# EAGLE schematic version2 (EAGLE 8.0.1)
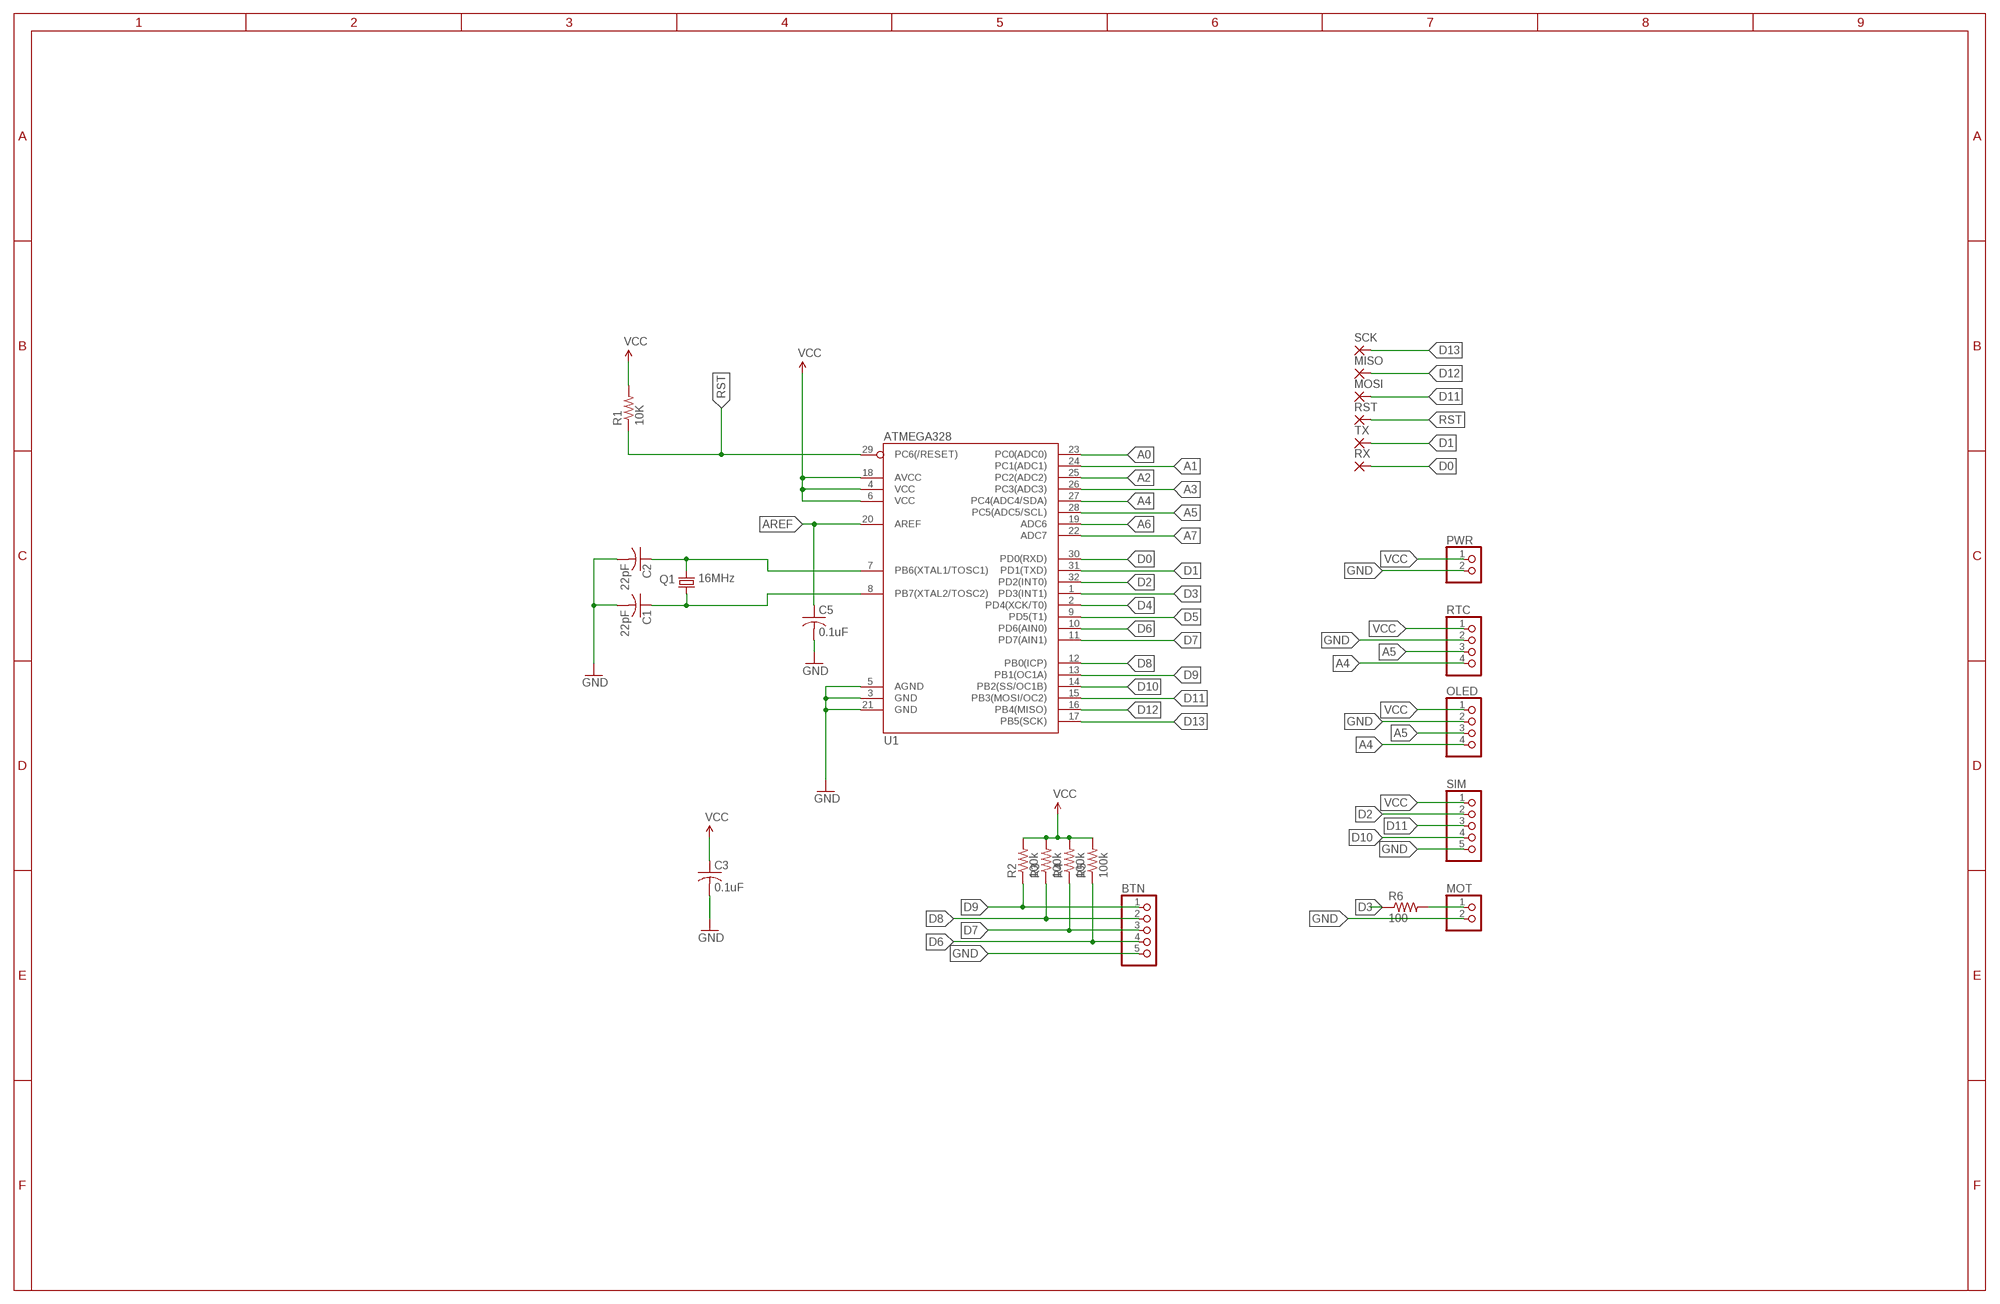
[diagram p0: schematic, sheet 1]
FRAME1 (FRAME_B_L): DESIGNER: PRATIK MAKWANA; DOC: 1; REV: 1.0.0

## Parts
BTN  PINHD-1X5  [1X05]
C1  22pF  C-USC1206  [C1206]
C2  22pF  C-USC1206  [C1206]
C3  0.1uF  C-USC0805  [C0805]
C5  0.1uF  C-USC0805  [C0805]
MISO  SMD2  [SMD1,27-2,54]
MOSI  SMD2  [SMD1,27-2,54]
MOT  PINHD-1X2  [1X02]
OLED  PINHD-1X4  [1X04]
PWR  PINHD-1X2  [1X02]
Q1  16MHz  CRYSTALTC26V  [TC26V]
R1  10K  R-US_R1206  [R1206]
R2  100k  R-US_R1206  [R1206]
R3  100k  R-US_R1206  [R1206]
R4  100k  R-US_R1206  [R1206]
R5  100k  R-US_R1206  [R1206]
R6  100  R-US_R1206  [R1206]
RST  SMD2  [SMD1,27-2,54]
RTC  PINHD-1X4  [1X04]
RX  SMD2  [SMD1,27-2,54]
SCK  SMD2  [SMD1,27-2,54]
SIM  PINHD-1X5  [1X05]
TX  SMD2  [SMD1,27-2,54]
U1  ATMEGA328  [TQFP32-08]

## Nets
A0: U1.23(PC0(ADC0))
A1: U1.24(PC1(ADC1))
A2: U1.25(PC2(ADC2))
A3: U1.26(PC3(ADC3))
A4: OLED.4 RTC.4 U1.27(PC4(ADC4/SDA))
A5: OLED.3 RTC.3 U1.28(PC5(ADC5/SCL))
A6: U1.19(ADC6)
A7: U1.22(ADC7)
AREF: C5.1 U1.20(AREF)
D0: RX.1(P) U1.30(PD0(RXD))
D1: TX.1(P) U1.31(PD1(TXD))
D2: SIM.2 U1.32(PD2(INT0))
D3: R6.1 U1.1(PD3(INT1))
D4: U1.2(PD4(XCK/T0))
D5: U1.9(PD5(T1))
D6: BTN.4 R5.1 U1.10(PD6(AIN0))
D7: BTN.3 R4.1 U1.11(PD7(AIN1))
D8: BTN.2 R3.1 U1.12(PB0(ICP))
D9: BTN.1 R2.1 U1.13(PB1(OC1A))
D10: SIM.4 U1.14(PB2(SS/OC1B))
D11: MOSI.1(P) SIM.3 U1.15(PB3(MOSI/OC2))
D12: MISO.1(P) U1.16(PB4(MISO))
D13: SCK.1(P) U1.17(PB5(SCK))
GND: BTN.5 C1.2 C2.2 C3.2 C5.2 MOT.2 OLED.2 PWR.2 RTC.2 SIM.5 U1.3(GND) U1.5(AGND) U1.21(GND)
N$1: MOT.1 R6.2
N$43: C2.1 Q1.2 U1.7(PB6(XTAL1/TOSC1))
N$44: C1.1 Q1.1 U1.8(PB7(XTAL2/TOSC2))
RST: R1.1 RST.1(P) U1.29(PC6(/RESET))
VCC: C3.1 OLED.1 PWR.1 R1.2 R2.2 R3.2 R4.2 R5.2 RTC.1 SIM.1 U1.4(VCC) U1.6(VCC) U1.18(AVCC)

## Library data of the parts
BTN SIM = pinhead:PINHD-1X5: PIN HEADER
C1-C3 C5 = adafruit:C-US: CAPACITOR, American symbol
MISO MOSI RST RX SCK TX = wirepad:SMD2: SMD PAD
MOT PWR = pinhead:PINHD-1X2: PIN HEADER
OLED RTC = pinhead:PINHD-1X4: PIN HEADER
Q1 = adafruit:CRYSTAL: CRYSTAL; OC_FARNELL: unknown; OC_NEWARK: unknown
R1-R6 = adafruit:R-US_: RESISTOR, American symbol
U1 = thecustomgeek:ATMEGA328: ATmega328P-AU TQFP 32 pin